# EAGLE design phychipDevelopmentBoardV0.9 (EAGLE 6.6.0)
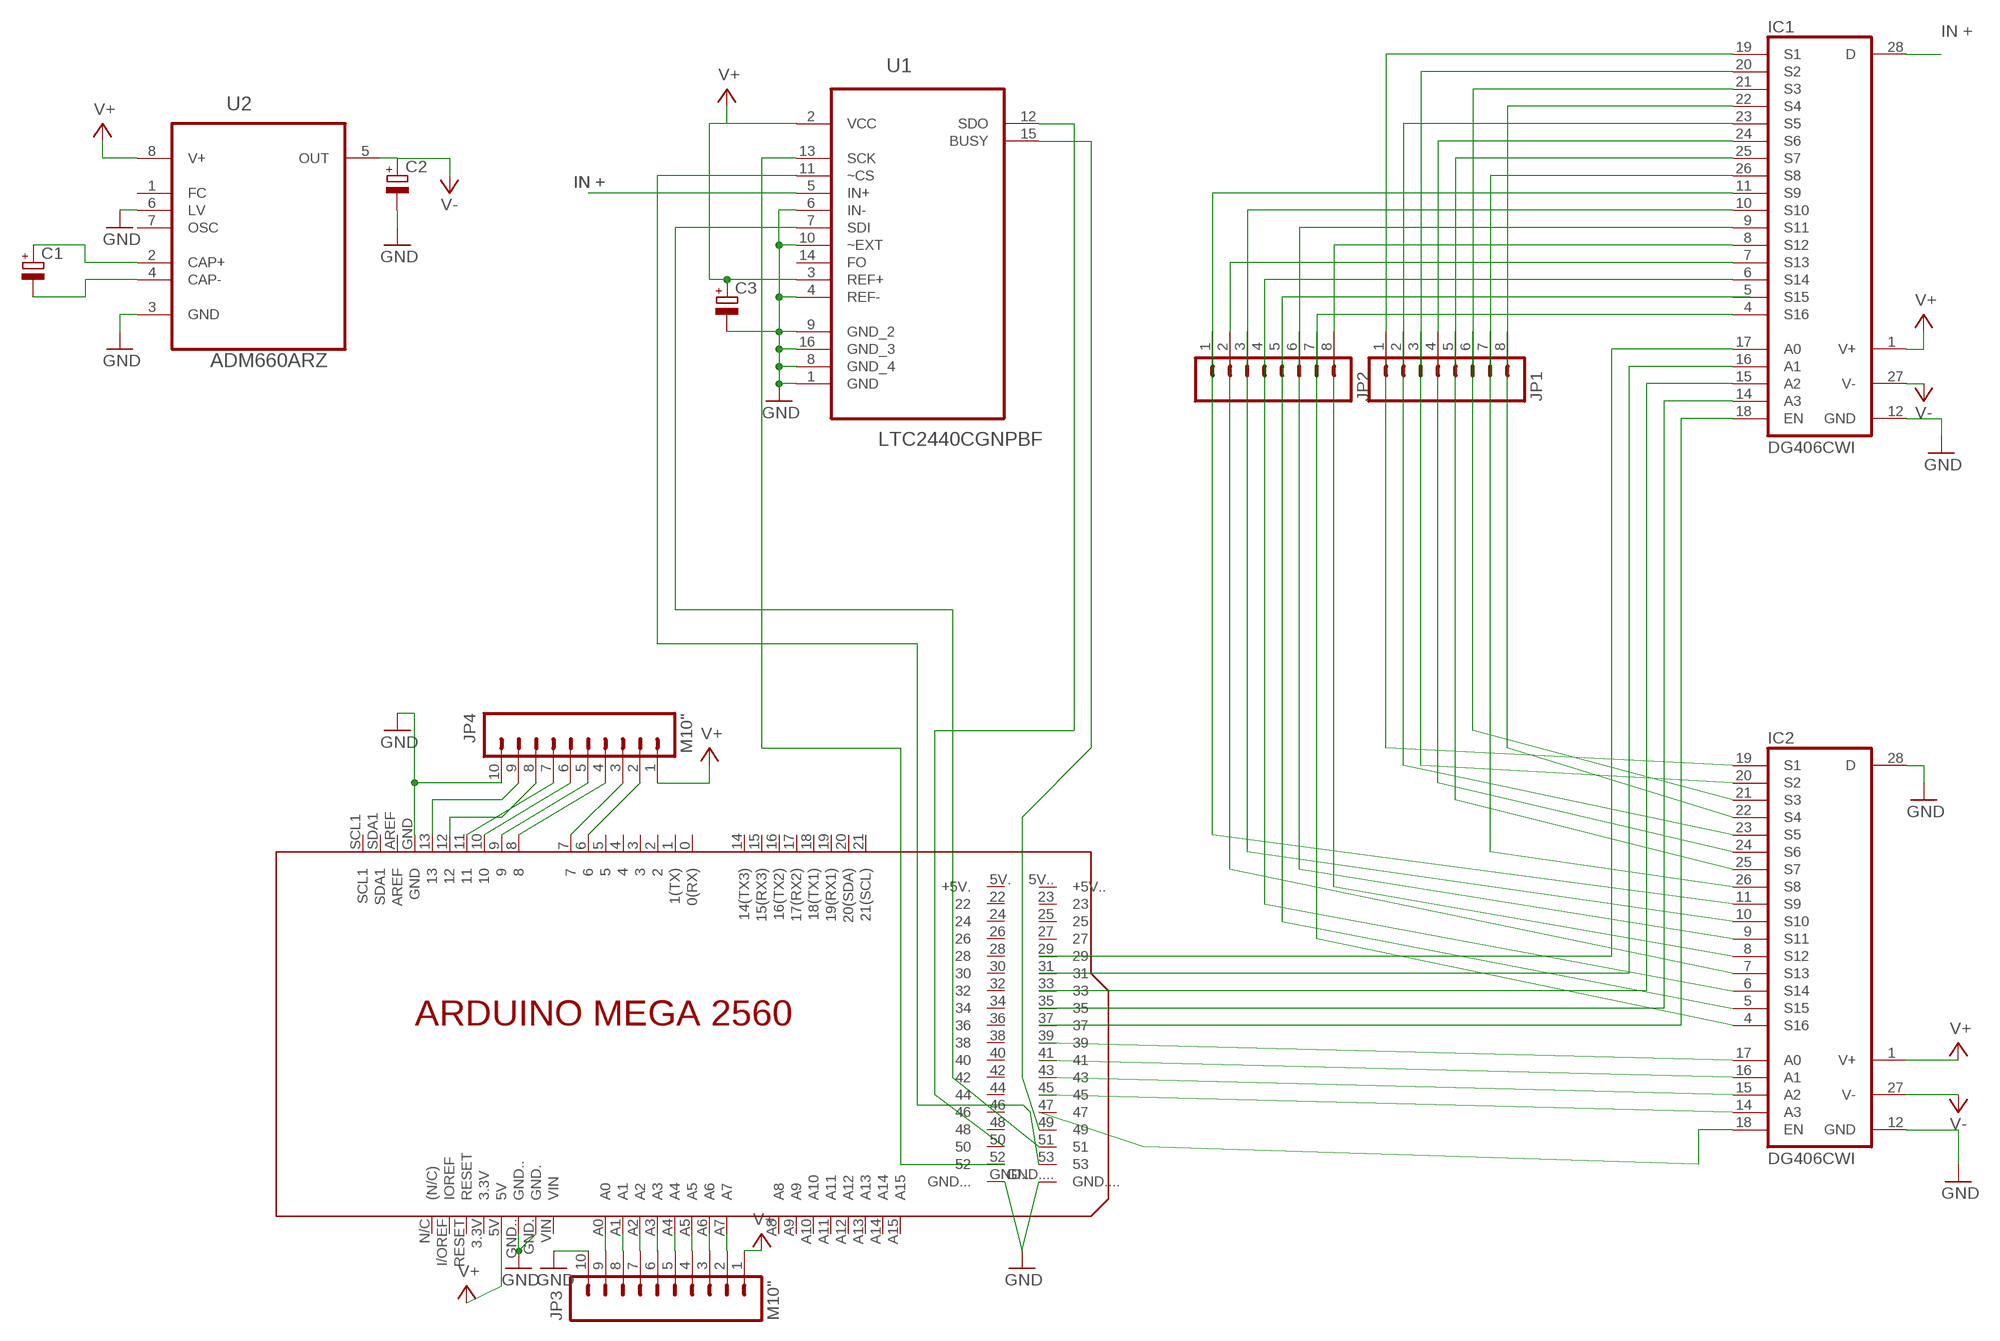
[diagram p0: schematic, sheet 1]

## Parts
C1  CPOL-EU153CLV-0505  [153CLV-0505]
C2  CPOL-EU153CLV-0505  [153CLV-0505]
C3  CPOL-EU153CLV-0505  [153CLV-0505]
IC1  DG406CWI  [SO28L]
IC2  DG406CWI  [SO28L]
JP1  M08  [1X08]
JP2  M08  [1X08]
JP3  M10"  [1X10]
JP4  M10"  [1X10]
PCB1  ARDUINO_MEGA2560  [ARDUINO_MEGA2560]
U1  LTC2440CGNPBF  [SOP63P600X175-16N]
U2  ADM660ARZ  [SOIC127P600X175-8N]

## Nets
GND: C2.- C3.- IC1.12(GND) IC2.12(GND) IC2.28(D) JP3.10 JP4.10 PCB1.GND PCB1.GND. PCB1.GND.. PCB1.GND... PCB1.GND.... U1.1(GND) U1.4(REF-) U1.6(IN-) U1.8(GND_4) U1.9(GND_2) U1.10(~EXT) U1.16(GND_3) U2.3(GND) U2.6(LV)
IN+: IC1.28(D) U1.5(IN+)
N$1: C1.+ U2.2(CAP+)
N$2: C1.- U2.4(CAP-)
N$3: PCB1.52 U1.13(SCK)
N$4: PCB1.50 U1.12(SDO)
N$5: PCB1.51 U1.7(SDI)
N$6: PCB1.49 U1.15(BUSY)
N$7: PCB1.53 U1.11(~CS)
N$8: IC2.18(EN) PCB1.47
N$9: IC2.14(A3) PCB1.45
N$10: IC2.15(A2) PCB1.43
N$11: IC2.16(A1) PCB1.41
N$12: IC2.17(A0) PCB1.39
N$13: IC1.18(EN) PCB1.37
N$14: IC1.14(A3) PCB1.35
N$15: IC1.15(A2) PCB1.33
N$16: IC1.16(A1) PCB1.31
N$17: IC1.17(A0) PCB1.29
N$18: IC1.19(S1) IC2.19(S1) JP1.1
N$19: IC1.20(S2) IC2.20(S2) JP1.3
N$20: IC1.21(S3) IC2.21(S3) JP1.6
N$21: IC1.22(S4) IC2.22(S4) JP1.8
N$22: IC1.23(S5) IC2.23(S5) JP1.2
N$23: IC1.24(S6) IC2.24(S6) JP1.4
N$24: IC1.25(S7) IC2.25(S7) JP1.5
N$25: IC1.26(S8) IC2.26(S8) JP1.7
N$26: IC1.11(S9) IC2.11(S9) JP2.1
N$27: IC1.10(S10) IC2.10(S10) JP2.3
N$28: IC1.9(S11) IC2.9(S11) JP2.6
N$29: IC1.8(S12) IC2.8(S12) JP2.8
N$30: JP3.9 PCB1.A0
N$31: JP3.8 PCB1.A1
N$32: JP3.7 PCB1.A2
N$33: JP3.6 PCB1.A3
N$34: JP3.5 PCB1.A4
N$35: JP3.4 PCB1.A5
N$36: JP3.3 PCB1.A6
N$37: JP3.2 PCB1.A7
N$38: IC1.7(S13) IC2.7(S13) JP2.2
N$39: JP4.9 PCB1.13
N$40: IC1.6(S14) IC2.6(S14) JP2.4
N$41: IC2.5(S15) JP2.5
N$42: IC1.4(S16) IC2.4(S16) JP2.7
N$43: JP4.8 PCB1.12
N$44: JP4.7 PCB1.11
N$45: JP4.6 PCB1.10
N$46: JP4.5 PCB1.9
N$47: JP4.4 PCB1.8
N$48: JP4.3 PCB1.7
N$49: JP4.2 PCB1.6
V+: C3.+ IC1.1(V+) IC2.1(V+) JP3.1 JP4.1 PCB1.5V U1.2(VCC) U1.3(REF+) U2.8(V+)
V-: C2.+ IC1.27(V-) IC2.27(V-) U2.5(OUT)
Unconnected: IC1.5(S15) PCB1.0(0(RX)) PCB1.1(1(TX)) PCB1.2 PCB1.3 PCB1.3.3V PCB1.4 PCB1.5 PCB1.5V.(+5V.) PCB1.5V..(+5V..) PCB1.14(14(TX3)) PCB1.15(15(RX3)) PCB1.16(16(TX2)) PCB1.17(17(RX2)) PCB1.18(18(TX1)) PCB1.19(19(RX1)) PCB1.20(20(SDA)) PCB1.21(21(SCL)) PCB1.22 PCB1.23 PCB1.24 PCB1.25 PCB1.26 PCB1.27 PCB1.28 PCB1.30 PCB1.32 PCB1.34 PCB1.36 PCB1.38 PCB1.40 PCB1.42 PCB1.44 PCB1.46 PCB1.48 PCB1.A8 PCB1.A9 PCB1.A10 PCB1.A11 PCB1.A12 PCB1.A13 PCB1.A14 PCB1.A15 PCB1.AREF PCB1.I/OREF(IOREF) PCB1.N/C((N/C)) PCB1.RESET PCB1.SCL1 PCB1.SDA1 PCB1.VIN U1.14(FO) U2.1(FC) U2.7(OSC)

## Notes on the sheet
- IN +
- IN + | IN +

## Library data of the parts
C1-C3 = rcl:CPOL-EU: POLARIZED CAPACITOR, European symbol
IC1 IC2 = maxim:DG406CWI: ANALOG MULTIPLEXER; MF: MAXIM; MPN: DG406CWI; OC_FARNELL: unknown; OC_NEWARK: 77C6458
JP1 JP2 = SparkFun:M08: Header 8 Standard 8-pin 0.1" header. Use with straight break away headers (SKU : PRT-00116), right angle break away headers (PRT-00553), swiss pins (PRT-00743), machine pins (PRT-00117), and female headers (PRT-00115).
JP3 JP4 = SparkFun:M10: Header 10 Standard 10-pin 0.1" header. Use with straight break away headers (SKU : PRT-00116), right angle break away headers (PRT-00553), swiss pins (PRT-00743), machine pins (PRT-00117), and female headers (PRT-00115).
PCB1 = E14_Arduino_revB:ARDUINO_MEGA2560: Device for representing an Arduino Mega 2560 board with a footprint in an EAGLE design. Created by Dave Young for Element14. More EAGLE documentation at: http://www.element14.com/community/community/knode/cadsoft_eagle
U1 = LTC_By_element14_Batch_1:LTC2440CGNPBF: ADC; MPN: LTC2440CGN#PBF; OC_FARNELL: 1651798; OC_NEWARK: 56M5608; PACKAGE: SSOP-16; SUPPLIER: Linear Technology
U2 = Analog Devices_By_element14_Batch_1:ADM660ARZ: CMOS Switched-Capacitor Voltage Converters; MPN: ADM660ARZ; OC_FARNELL: 1661070; OC_NEWARK: 19M8699; PACKAGE: SOIC-8; SUPPLIER: Analog Devices

## Board
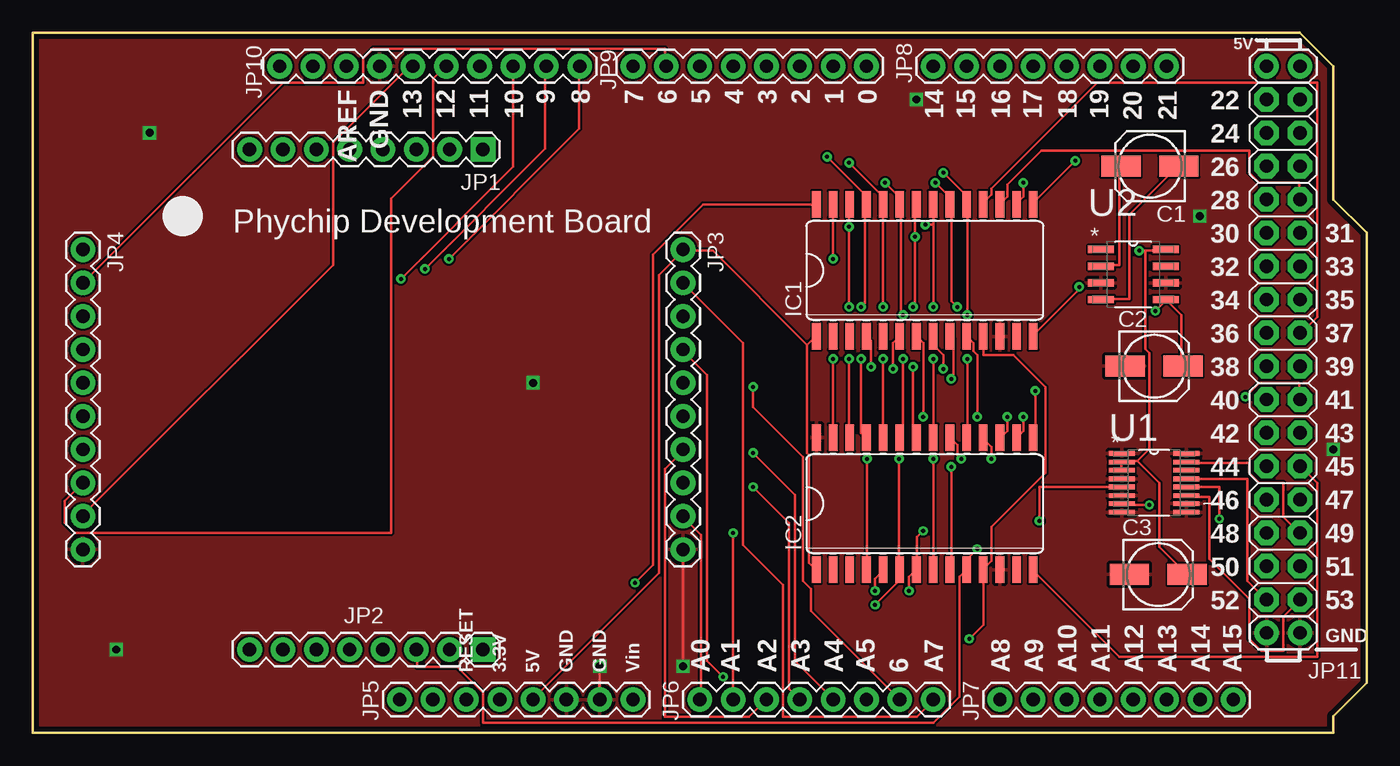
[diagram p1: board, top side]
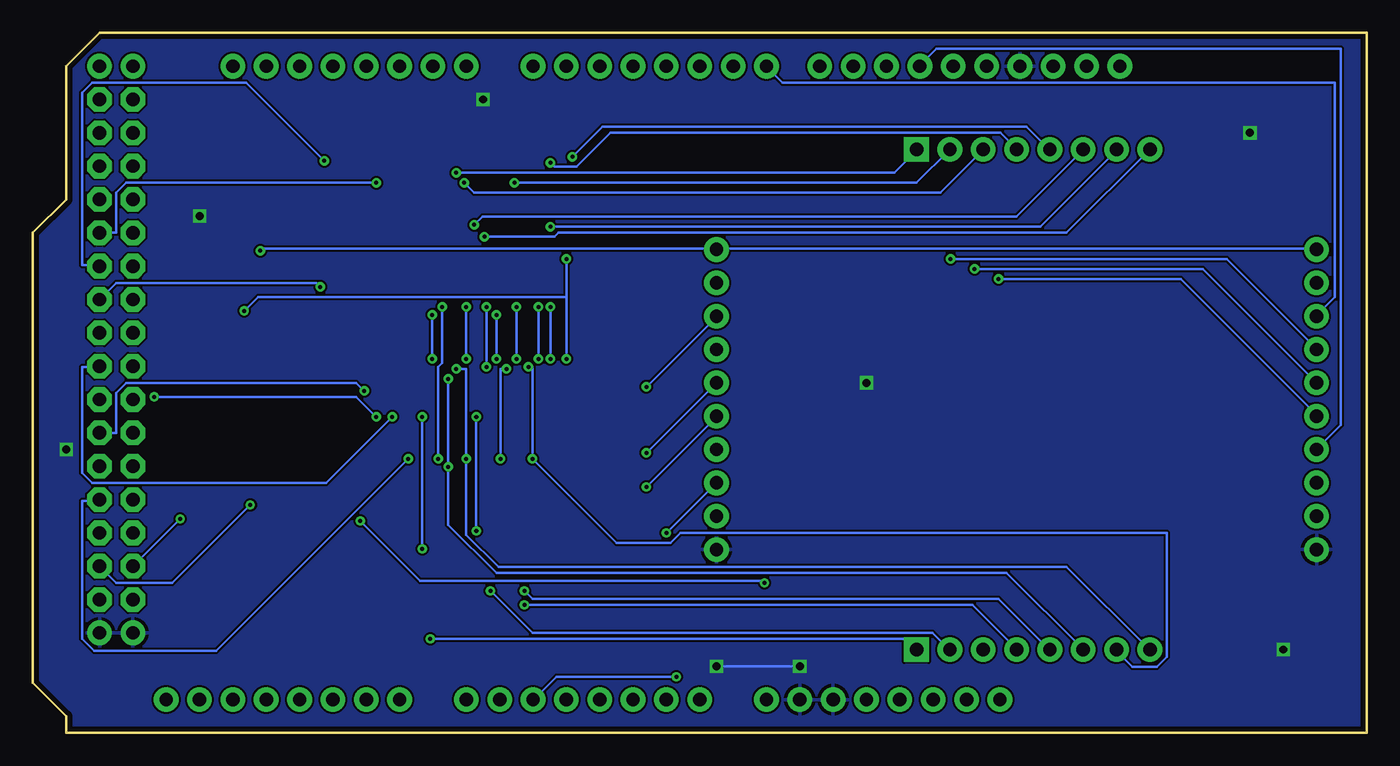
[diagram p2: board, bottom side, seen from below]

Size 101.6 x 53.34 mm. Coordinates in mm from the lower left corner, seen from the top.
Outline: 0,0 99.04,0 99.06,1.27 101.6,3.81 101.6,38.1 99.04,40.66 99.04,50.79 96.53,53.33 96.52,53.34 0,53.33 0,0
Copper layers (1*16): Top 0.035mm / dielectric 1.5mm / Bottom 0.035mm
Design rules "default *": minimum track width 8mil, minimum drill 12mil, track to track 6mil, track to pad 8mil, pad to pad 8mil, via to via 8mil, smd to smd 8mil, copper to edge 15mil, drill to drill 8mil, minimum pad ring 10mil, minimum via ring 8mil, stop-mask expansion 4mil, vias tented up to drill 0mil, thermal gap 10mil

### Footprints (pad centres in the part's own frame; a part is rotated, then mirrored left to right if it is on the bottom)
153CLV-0505 = smd 3 x 1.6: + 2.2,0; - -2.2,0
SO28L = smd 0.66 x 2.032: 1 -8.255,-5.029; 2 -6.985,-5.029; 3 -5.715,-5.029; 4 -4.445,-5.029; 5 -3.175,-5.029; 6 -1.905,-5.029; 7 -0.635,-5.029; 8 0.635,-5.029; 9 1.905,-5.029; 10 3.175,-5.029; 11 4.445,-5.029; 12 5.715,-5.029; 13 6.985,-5.029; 14 8.255,-5.029; 15 8.255,5.029; 16 6.985,5.029; 17 5.715,5.029; 18 4.445,5.029; 19 3.175,5.029; 20 1.905,5.029; 21 0.635,5.029; 22 -0.635,5.029; 23 -1.905,5.029; 24 -3.175,5.029; 25 -4.445,5.029; 26 -5.715,5.029; 27 -6.985,5.029; 28 -8.255,5.029
1X08 = drill 1.016 pad 1.88 square: 1 0,0 | drill 1.016 pad 1.88: 2 2.54,0; 3 5.08,0; 4 7.62,0; 5 10.16,0; 6 12.7,0; 7 15.24,0; 8 17.78,0
1X10 = drill 1.016 pad 1.88: 1 0,0; 2 2.54,0; 3 5.08,0; 4 7.62,0; 5 10.16,0; 6 12.7,0; 7 15.24,0; 8 17.78,0; 9 20.32,0; 10 22.86,0
ARDUINO_MEGA2560 = drill 1.016 pad 1.88: 0 63.5,50.8; 1 60.96,50.8; 2 58.42,50.8; 3 55.88,50.8; 3.3V 35.56,2.54; 4 53.34,50.8; 5 50.8,50.8; 5V 38.1,2.54; 5V. 93.98,50.8; 5V.. 96.52,50.8; 6 48.26,50.8; 7 45.72,50.8; 8 41.656,50.8; 9 39.116,50.8; 10 36.576,50.8; 11 34.036,50.8; 12 31.496,50.8; 13 28.956,50.8; 14 68.58,50.8; 15 71.12,50.8; 16 73.66,50.8; 17 76.2,50.8; 18 78.74,50.8; 19 81.28,50.8; 20 83.82,50.8; 21 86.36,50.8; A0 50.8,2.54; A1 53.34,2.54; A2 55.88,2.54; A3 58.42,2.54; A4 60.96,2.54; A5 63.5,2.54; A6 66.04,2.54; A7 68.58,2.54; A8 73.66,2.54; A9 76.2,2.54; A10 78.74,2.54; A11 81.28,2.54; A12 83.82,2.54; A13 86.36,2.54; A14 88.9,2.54; A15 91.44,2.54; AREF 23.876,50.8; GND 26.416,50.8; GND. 43.18,2.54; GND.. 40.64,2.54; GND... 93.98,7.62; GND.... 96.52,7.62; I/OREF 30.48,2.54; N/C 27.94,2.54; RESET 33.02,2.54; SCL1 18.796,50.8; SDA1 21.336,50.8; VIN 45.72,2.54 | drill 1.016 pad 1.88 octagon: 22 93.98,48.26; 23 96.52,48.26; 24 93.98,45.72; 25 96.52,45.72; 26 93.98,43.18; 27 96.52,43.18; 28 93.98,40.64; 29 96.52,40.64; 30 93.98,38.1; 31 96.52,38.1; 32 93.98,35.56; 33 96.52,35.56; 34 93.98,33.02; 35 96.52,33.02; 36 93.98,30.48; 37 96.52,30.48; 38 93.98,27.94; 39 96.52,27.94; 40 93.98,25.4; 41 96.52,25.4; 42 93.98,22.86; 43 96.52,22.86; 44 93.98,20.32; 45 96.52,20.32; 46 93.98,17.78; 47 96.52,17.78; 48 93.98,15.24; 49 96.52,15.24; 50 93.98,12.7; 51 96.52,12.7; 52 93.98,10.16; 53 96.52,10.16
SOP63P600X175-16N = smd 1.981 x 0.356: 1 -2.464,2.235; 2 -2.464,1.575; 3 -2.464,0.965; 4 -2.464,0.305; 5 -2.464,-0.305; 6 -2.464,-0.965; 7 -2.464,-1.575; 8 -2.464,-2.235; 9 2.464,-2.235; 10 2.464,-1.575; 11 2.464,-0.965; 12 2.464,-0.305; 13 2.464,0.305; 14 2.464,0.965; 15 2.464,1.575; 16 2.464,2.235
SOIC127P600X175-8N = smd 1.981 x 0.559: 1 -2.464,1.905; 2 -2.464,0.635; 3 -2.464,-0.635; 4 -2.464,-1.905; 5 2.464,-1.905; 6 2.464,-0.635; 7 2.464,0.635; 8 2.464,1.905

### Placement (x,y rotation side)
C1  10uF  [153CLV-0505]  85.09,43.18 180 top
C2  10uF  [153CLV-0505]  85.41,27.94 0 top
C3  10uF  [153CLV-0505]  85.72,12.06 0 top
IC1  67.94,35.24 0 top
IC2  67.94,17.46 0 top
JP1  34.29,44.45 180 top
JP2  34.29,6.35 180 top
JP3  49.53,36.83 270 top
JP4  3.81,36.83 270 top
PCB1  0,0 0 top
U1  85.41,19.05 0 top
U2  83.82,34.92 0 top

### Tracks (layer width: path | path; a pad name or v marks a point on that pad's centre or on a via)
GND  (via drill 0.6)
  Top 0.203: JP3.10 v49.53,5.08 | v43.18,5.08 PCB1.GND.
  Bottom 0.203: v49.53,5.08 v43.18,5.08
  other vias: 38.1,26.67 6.35,6.35 8.89,45.72 67.31,48.26 99.06,21.59 88.9,39.37
  pour Bottom: 0,53.34 96.52,53.34 99.06,50.8 99.06,40.64 101.6,38.1 101.6,3.81 99.06,1.27 99.06,0 0,0
  pour Top: 0,53.34 96.52,53.34 99.06,50.8 99.06,40.64 101.6,38.1 101.6,3.81 99.06,1.27 99.06,0 0,0
IN+  (via drill 0.3)
  Top 0.203: U1.5 76.66,18.75 v76.66,16.15 | v45.87,11.43 47.24,12.8 47.24,36.42 51.05,40.23 59.59,40.23 IC1.28
  Bottom 0.203: v76.66,16.15 72.08,11.58 46.02,11.58 v45.87,11.43
N$1
  Top 0.203: U2.2 81.38,35.66 82.75,35.66 82.75,43.13 C1.+
N$2
  Top 0.203: U2.4 81.38,33.07 83.52,33.07 83.52,39.47 87.17,43.13 C1.-
N$3
  Top 0.203: U1.13 92.51,19.36 92.51,11.58 93.88,10.21 PCB1.52
N$4  (via drill 0.3)
  Top 0.203: U1.12 90.37,18.75 v90.37,16.31
  Bottom 0.203: PCB1.50 v90.37,16.31
N$5  (via drill 0.3)
  Top 0.203: v85.04,17.37 83.06,17.37 U1.7
  Bottom 0.203: v85.04,17.37 90.98,11.43 95.25,11.43 PCB1.51
N$6
  Top 0.203: U1.15 87.94,20.57 92.66,20.57 92.66,19.81 93.42,19.05 95.25,19.05 95.25,16.46 96.47,15.24 PCB1.49
N$7
  Top 0.203: U1.11 87.94,17.98 89.61,17.98 89.61,13.26 92.66,10.21 92.66,7.16 93.57,6.25 95.25,6.25 95.25,8.84 96.47,10.06 PCB1.53
N$8  (via drill 0.3)
  Top 0.203: v73,20.88 73,21.79 72.39,22.4 IC2.18
  Bottom 0.203: v73,20.88 87.63,6.25 96.93,6.25 97.84,7.16 97.84,17.68 96.62,17.68 PCB1.47
N$9
  Top 0.203: IC2.14 76.2,12.34 82.75,5.79 97.84,5.79 97.84,19.05 96.62,20.27 PCB1.45
N$10  (via drill 0.3)
  Top 0.203: v76.35,26.06 76.35,22.71 76.2,22.55 IC2.15
  Bottom 0.203: v76.35,26.06 76.96,26.67 94.49,26.67 95.25,25.91 95.25,22.86 PCB1.43
N$11  (via drill 0.3)
  Top 0.203: v75.44,24.08 75.44,23.01 74.98,22.55 IC2.16 | v92.35,25.6 93.42,26.67 96.47,26.67 96.47,25.45 PCB1.41
  Bottom 0.203: v75.44,24.08 76.96,25.6 v92.35,25.6
N$12  (via drill 0.3)
  Top 0.203: v74.22,24.08 74.22,23.01 73.76,22.55 IC2.17
  Bottom 0.203: v74.22,24.08 79.25,19.05 97.08,19.05 97.84,19.81 97.84,27.89 96.62,27.89 PCB1.39
N$13
  Top 0.203: IC1.18 72.39,40.39 73,41 73,41.45 81.08,49.53 97.84,49.53 97.84,31.7 96.62,30.48 PCB1.37
N$14  (via drill 0.3)
  Top 0.203: v79.7,33.98 79.7,33.83 76.2,30.33 IC1.14
  Bottom 0.203: v79.7,33.98 80.01,34.29 95.25,34.29 PCB1.35
N$15  (via drill 0.3)
  Top 0.203: v79.4,43.59 76.2,40.39 IC1.15
  Bottom 0.203: v79.4,43.59 85.34,49.53 97.08,49.53 97.84,48.77 97.84,35.66 96.62,35.66 PCB1.33
N$16  (via drill 0.3)
  Top 0.203: v75.44,41.91 75.44,40.84 74.98,40.39 IC1.16
  Bottom 0.203: v75.44,41.91 94.49,41.91 95.25,41.15 95.25,38.1 PCB1.31
N$17
  Top 0.203: IC1.17 73.76,40.39 74.22,40.84 74.22,41.76 76.81,44.35 92.66,44.35 92.66,42.67 93.42,41.91 96.47,41.91 96.47,40.69 PCB1.29
N$18  (via drill 0.3)
  Top 0.203: v71.17,28.5 71.17,22.55 IC2.19 | v71.17,31.85 71.17,40.23 IC1.19 71.02,40.39 71.02,41 v69.34,42.67
  Bottom 0.203: v71.17,31.85 v71.17,28.5 | v69.34,42.67 35.97,42.67 34.29,44.35 JP1.1
N$19  (via drill 0.3)
  Top 0.203: v70.71,20.88 70.41,21.18 70.41,21.95 69.95,22.4 IC2.20 | v70.41,32.46 69.95,32.92 69.95,40.23 IC1.20 69.8,40.39 69.8,40.84 v68.73,41.91
  Bottom 0.203: v70.71,20.88 70.71,27.89 70.41,28.19 v70.41,32.46 | v68.73,41.91 67.97,41.15 32.46,41.15 29.26,44.35 JP1.3
N$20  (via drill 0.3)
  Top 0.203: v68.58,28.5 IC2.21 | IC1.21 68.58,38.71 | 68.58,38.71 v68.58,32.46 | 68.58,38.71 v67.97,38.71
  Bottom 0.203: v68.58,32.46 v68.58,28.5 | v67.97,38.71 67.36,39.32 26.67,39.32 21.64,44.35 JP1.6
N$21  (via drill 0.3)
  Top 0.203: v67.06,27.89 67.06,22.71 67.21,22.55 IC2.22 | v67.06,32.46 67.21,32.61 v67.21,37.8 67.21,40.23 IC1.22
  Bottom 0.203: v67.06,32.46 v67.06,27.89 | JP1.8 22.86,38.1 61.57,38.1 61.87,37.8 v67.21,37.8
N$22  (via drill 0.3)
  Top 0.203: v66.29,28.5 66.29,22.71 66.14,22.55 IC2.23 | v66.29,31.85 66.14,32 66.14,40.23 IC1.23 65.99,40.39 65.99,40.84 v64.92,41.91
  Bottom 0.203: v66.29,31.85 v66.29,28.5 | JP1.2 34.29,41.91 v64.92,41.91
N$23  (via drill 0.3)
  Top 0.203: v64.77,28.5 IC2.24 | v64.77,32.46 IC1.24 64.77,40.84 v62.18,43.43
  Bottom 0.203: v64.77,32.46 v64.77,28.5 | v62.18,43.43 61.87,43.13 60.2,43.13 57.61,45.72 27.89,45.72 26.67,44.5 JP1.4
N$24  (via drill 0.3)
  Top 0.203: v63.09,28.5 63.09,22.86 63.4,22.55 IC2.25 | v63.09,32.46 63.4,32.77 63.4,40.23 IC1.25 63.4,40.39 63.4,41 v60.5,43.89
  Bottom 0.203: v63.09,32.46 v63.09,28.5 | v60.5,43.89 58.22,46.18 25.91,46.18 24.23,44.5 JP1.5
N$25  (via drill 0.3)
  Top 0.203: v62.18,28.5 62.18,22.55 IC2.26 | v62.18,32.46 v62.18,38.56 62.18,40.23 IC1.26
  Bottom 0.203: v62.18,32.46 v62.18,28.5 | v62.18,38.56 24.84,38.56 19.05,44.35 JP1.7
N$26  (via drill 0.3)
  Top 0.203: IC1.11 72.39,28.8 74.68,28.8 77.11,26.36 77.11,19.81 73,15.7 73,13.11 72.39,12.5 IC2.11 72.39,8.23 v71.32,7.16
  Bottom 0.203: v71.32,7.16 35.05,7.16 34.29,6.4 JP2.1
N$27  (via drill 0.3)
  Top 0.203: JP2.3 29.26,6.25 29.26,5.03 32.31,5.03 34.29,3.05 34.29,0.76 68.58,0.76 70.56,2.74 70.56,11.89 71.02,12.34 IC2.10 71.17,12.5 71.17,13.26 v71.93,14.02 | v71.93,24.08 71.93,28.8 71.63,29.11 71.63,29.72 71.17,30.18 IC1.10
  Bottom 0.203: v71.93,14.02 v71.93,24.08
N$28  (via drill 0.3)
  Top 0.203: v69.95,20.27 69.95,12.5 IC2.9 | v69.95,26.98 70.1,27.13 70.1,30.02 69.95,30.18 IC1.9
  Bottom 0.203: v69.95,26.98 v69.95,20.27 69.95,15.85 66.29,12.19 27.43,12.19 JP2.6
N$29  (via drill 0.3)
  Top 0.203: v68.58,20.88 IC2.8 | v69.34,27.74 69.34,28.8 68.58,29.57 IC1.8
  Bottom 0.203: v69.34,27.74 68.58,27.74 v68.58,20.88 68.58,15.09 66.14,12.65 22.86,12.65 16.61,6.4 JP2.8
N$30
  Top 0.203: PCB1.A0 50.9,2.59 50.9,15.09 49.53,16.46 JP3.9
N$31  (via drill 0.3)
  Top 0.203: v53.34,15.24 PCB1.A1
  Bottom 0.203: JP3.8 v53.34,15.24
N$32
  Top 0.203: PCB1.A2 54.56,1.22 48.16,1.22 48.16,20.12 49.53,21.49 JP3.7
N$33  (via drill 0.3)
  Top 0.203: PCB1.A3 57.61,3.35 57.61,16 v54.86,18.75
  Bottom 0.203: v54.86,18.75 49.53,24.08 JP3.6
N$34  (via drill 0.3)
  Top 0.203: v54.86,21.34 58.06,18.14 58.06,5.49 60.96,2.59 PCB1.A4
  Bottom 0.203: JP3.5 v54.86,21.34
N$35  (via drill 0.3)
  Top 0.203: v52.58,4.27 51.36,5.49 51.36,27.28 49.53,29.11 JP3.4
  Bottom 0.203: v52.58,4.27 61.72,4.27 63.4,2.59 PCB1.A5
N$36  (via drill 0.3)
  Top 0.203: PCB1.A6 59.28,9.3 59.28,10.97 58.67,11.58 58.67,21.03 54.86,24.84 v54.86,26.36
  Bottom 0.203: v54.86,26.36 49.53,31.7 JP3.3
N$37
  Top 0.203: JP3.2 54.1,29.72 54.1,14.33 57.15,11.28 57.15,1.22 67.36,1.22 68.58,2.44 PCB1.A7
N$38  (via drill 0.3)
  Top 0.203: v66.75,10.82 66.75,11.89 67.21,12.34 IC2.7 67.36,12.5 67.36,14.94 v67.82,15.39 | v67.82,24.08 67.82,29.72 67.36,30.18 IC1.7
  Bottom 0.203: v66.75,10.82 63.55,7.62 33.07,7.62 31.85,6.4 JP2.2 | v67.82,15.39 v67.82,24.08
N$39
  Top 0.203: JP4.9 3.81,16.61 22.86,35.66 22.86,44.96 28.65,50.75 28.96,50.75 PCB1.13
N$40  (via drill 0.3)
  Top 0.203: v65.99,20.88 65.99,12.5 IC2.6 65.99,12.34 65.99,11.58 v64.16,9.75 | v65.53,27.74 65.53,29.72 65.99,30.18 IC1.6
  Bottom 0.203: v65.99,20.88 65.99,27.74 v65.53,27.74 | v64.16,9.75 30.02,9.75 26.67,6.4 JP2.4
N$41  (via drill 0.3)
  Top 0.203: v64.16,10.82 64.16,11.73 64.77,12.34 IC2.5
  Bottom 0.203: v64.16,10.82 63.55,10.21 28.04,10.21 24.23,6.4 JP2.5
N$42  (via drill 0.3)
  Top 0.203: v63.55,20.88 63.55,12.5 IC2.4 | v63.86,27.89 63.86,29.87 63.55,30.18 IC1.4
  Bottom 0.203: v63.86,27.89 63.55,27.89 v63.55,20.88 57.15,14.48 53.03,14.48 52.27,15.24 15.24,15.24 15.24,5.79 16,5.03 17.83,5.03 19.05,6.25 JP2.7
N$43
  Top 0.203: JP4.8 2.44,17.68 2.44,16 3.2,15.24 27.28,15.24 27.28,40.69 30.48,43.89 30.48,49.84 31.39,50.75 PCB1.12
N$44
  Bottom 0.203: JP4.7 3.81,21.64 1.98,23.47 1.98,52.12 32.77,52.12 33.98,50.9 PCB1.11
N$45  (via drill 0.3)
  Top 0.203: v28.04,34.59 36.58,43.13 PCB1.10
  Bottom 0.203: v28.04,34.59 14.17,34.59 3.81,24.23 JP4.6
N$46  (via drill 0.3)
  Top 0.203: v29.87,35.36 39.01,44.5 39.01,50.75 PCB1.9
  Bottom 0.203: JP4.5 12.5,35.36 v29.87,35.36
N$47  (via drill 0.3)
  Top 0.203: v31.7,36.12 41.6,46.02 41.6,50.75 PCB1.8
  Bottom 0.203: v31.7,36.12 10.67,36.12 3.81,29.26 JP4.4
N$48
  Bottom 0.203: JP4.3 3.81,31.85 2.44,33.22 2.44,49.53 44.5,49.53 45.72,50.75 PCB1.7
N$49
  Top 0.203: JP4.2 19.05,49.53 25.15,49.53 25.15,51.36 25.91,52.12 48.16,52.12 48.16,50.9 PCB1.6
V+  (via drill 0.3)
  Top 0.203: U1.3 82.91,20.12 82.91,20.57 U1.2 83.06,20.73 84.12,20.73 | 84.73,36.73 86.26,36.73 U2.8 | 84.73,36.73 84.73,29.26 85.04,28.96 85.04,21.64 84.12,20.73 | 84.12,20.73 85.8,19.05 85.8,14.17 87.78,12.19 C3.+ | 58.98,29.57 58.98,21.34 59.13,21.18 59.13,12.95 59.59,12.5 IC2.1 | 58.98,29.57 59.59,30.18 IC1.1 | 49.53,36.73 47.7,34.9 47.7,12.19 38.1,2.59 PCB1.5V | 58.98,29.57 51.82,36.73 49.53,36.73 | 49.53,36.73 JP3.1 | v84.28,36.73 84.73,36.73
  Bottom 0.203: 49.53,36.88 3.81,36.88 JP4.1 | v84.28,36.73 84.12,36.88 49.53,36.88 | 49.53,36.88 JP3.1
V-  (via drill 0.3)
  Top 0.203: C2.+ 87.48,28.04 87.48,31.85 86.41,32.92 U2.5 86.26,32.92 v85.5,32.16 | v60.96,28.5 IC2.27 | IC1.27 v60.96,36.12
  Bottom 0.203: v60.96,36.12 60.96,33.22 | 60.96,33.22 v60.96,28.5 | v85.5,32.16 84.43,33.22 60.96,33.22

### Text on the board
tPlace: Phychip Development Board
tNames: JP10 | JP9 | JP8 | JP11 | JP5 | JP6 | JP7